# Altium schematic sheet Power 12V_5V.SchDoc
size 250 x 320 mm; SheetNumber: 3; SheetTotal: 12
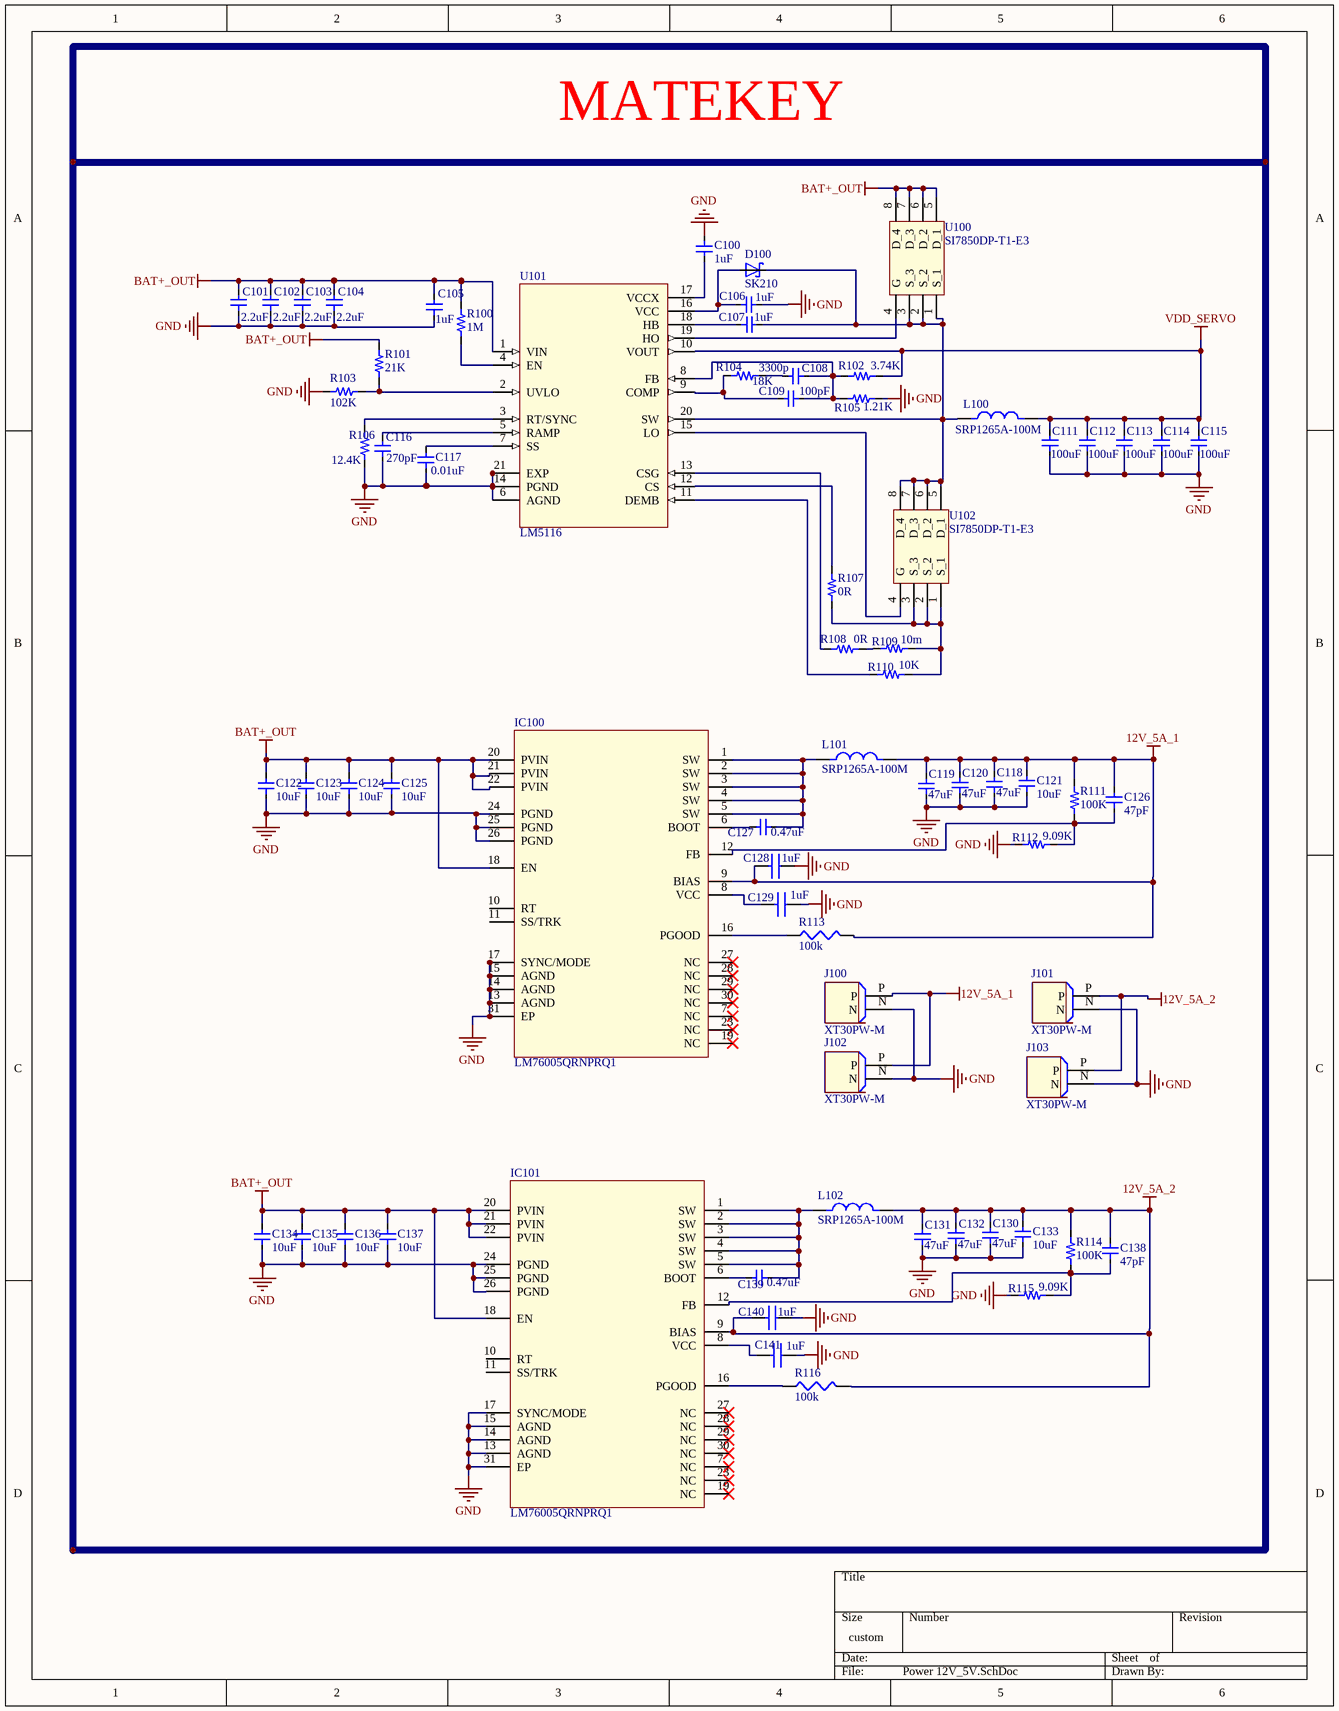
[diagram p0: Power 12V_5V.SchDoc]

## Parts
C100  1uF  [C0603]
C101  2.2uF  [C1812]
C102  2.2uF  [C1812]
C103  2.2uF  [C1812]
C104  2.2uF  [C1812]
C105  1uF  [C1210]
C106  1uF  [C0603]
C107  1uF  [C0603]
C108  3300p  [C0603]
C109  100pF  [C0603]
C111  100uF  [C1812]
C112  100uF  [C1812]
C113  100uF  [C1812]
C114  100uF  [C1812]
C115  100uF  [C1812]
C116  270pF  [C0603]
C117  0.01uF  [C0603]
C118  47uF  [C1210]
C119  47uF  [C1210]
C120  47uF  [C1210]
C121  10uF  [C0603]
C122  10uF  [C1206]
C123  10uF  [C1206]
C124  10uF  [C1206]
C125  10uF  [C1206]
C126  47pF  [C0603]
C127  0.47uF  [C0603]
C128  1uF  [C0402]
C129  1uF  [C0402]
C130  47uF  [C1210]
C131  47uF  [C1210]
C132  47uF  [C1210]
C133  10uF  [C0603]
C134  10uF  [C1206]
C135  10uF  [C1206]
C136  10uF  [C1206]
C137  10uF  [C1206]
C138  47pF  [C0603]
C139  0.47uF  [C0603]
C140  1uF  [C0402]
C141  1uF  [C0402]
D100  SK210  [SK210]
IC100  LM76005QRNPRQ1  [30-WFQFN Exposed Pad]
IC101  LM76005QRNPRQ1  [30-WFQFN Exposed Pad]
J100  XT30PW-M  [XT30PW-M]
J101  XT30PW-M  [XT30PW-M]
J102  XT30PW-M  [XT30PW-M]
J103  XT30PW-M  [XT30PW-M]
L100  SRP1265A-100M  [SRP1265A-100M]
L101  SRP1265A-100M  [SRP1265A-100M]
L102  SRP1265A-100M  [SRP1265A-100M]
R100  1M  [R0603]
R101  21K  [R0603]
R102  3.74K  [R0603]
R103  102K  [R0603]
R104  18K  [R0603]
R105  1.21K  [R0603]
R106  12.4K  [R0603]
R107  0R  [R0603]
R108  0R  [R0603]
R109  10m  [R2010]
R110  10K  [R0402]
R111  100K  [R0603]
R112  9.09K  [R0603]
R113  100k  [R0402]
R114  100K  [R0603]
R115  9.09K  [R0603]
R116  100k  [R0402]
U100  SI7850DP-T1-E3  [SO-8 Single]
U101  LM5116  [HTSSOP-20]
U102  SI7850DP-T1-E3  [SO-8 Single]

## Nets
12V_5A_1: C118.2 C119.2 C120.2 C121.2 C126.2 C128.2 IC100.9(BIAS) J100.P J102.P L101.2 R111.2 R113.2
12V_5A_2: C130.2 C131.2 C132.2 C133.2 C138.2 C140.2 IC101.9(BIAS) J101.P J103.P L102.2 R114.2 R116.2
BAT+_OUT: C101.2 C102.2 C103.2 C104.2 C105.2 C122.2 C123.2 C124.2 C125.2 C134.2 C135.2 C136.2 C137.2 IC100.18(EN) IC100.20(PVIN) IC100.21(PVIN) IC100.22(PVIN) IC101.18(EN) IC101.20(PVIN) IC101.21(PVIN) IC101.22(PVIN) R100.2 R101.1 U100.5(D_1) U100.6(D_2) U100.7(D_3) U100.8(D_4) U101.1(VIN)
GND: C100.1 C101.1 C102.1 C103.1 C104.1 C105.1 C106.2 C111.1 C112.1 C113.1 C114.1 C115.1 C116.1 C117.1 C118.1 C119.1 C120.1 C121.1 C122.1 C123.1 C124.1 C125.1 C128.1 C129.1 C130.1 C131.1 C132.1 C133.1 C134.1 C135.1 C136.1 C137.1 C140.1 C141.1 IC100.13(AGND) IC100.14(AGND) IC100.15(AGND) IC100.17(SYNC/MODE) IC100.24(PGND) IC100.25(PGND) IC100.26(PGND) IC100.31(EP) IC101.13(AGND) IC101.14(AGND) IC101.15(AGND) IC101.17(SYNC/MODE) IC101.24(PGND) IC101.25(PGND) IC101.26(PGND) IC101.31(EP) J100.N J101.N J102.N J103.N R103.2 R105.1 R106.1 R112.1 R115.1 U101.14(PGND) U101.21(EXP)
VDD_SERVO: C111.2 C112.2 C113.2 C114.2 C115.2 L100.2 R102.2 U101.10(VOUT)
NetC100_2: C100.2 U101.17(VCCX)
NetC106_1: C106.1 D100.A U101.16(VCC)
NetC107_1: C107.1 U101.18(HB)
NetC107_2: C107.2 D100.K L100.1 U100.1(S_1) U100.2(S_2) U100.3(S_3) U101.20(SW) U102.5(D_1) U102.6(D_2) U102.7(D_3) U102.8(D_4)
NetC108_1: C108.1 C109.1 R102.1 R105.2 U101.8(FB)
NetC108_2: C108.2 R104.1
NetC109_2: C109.2 R104.2 U101.9(COMP)
NetC116_2: C116.2 U101.5(RAMP)
NetC117_2: C117.2 U101.7(SS)
NetC126_1: C126.1 IC100.12(FB) R111.1 R112.2
NetC127_1: C127.1 IC100.1(SW) IC100.2(SW) IC100.3(SW) IC100.4(SW) IC100.5(SW) L101.1
NetC127_2: C127.2 IC100.6(BOOT)
NetC129_2: C129.2 IC100.8(VCC)
NetC138_1: C138.1 IC101.12(FB) R114.1 R115.2
NetC139_1: C139.1 IC101.1(SW) IC101.2(SW) IC101.3(SW) IC101.4(SW) IC101.5(SW) L102.1
NetC139_2: C139.2 IC101.6(BOOT)
NetC141_2: C141.2 IC101.8(VCC)
NetIC100_16: IC100.16(PGOOD) R113.1
NetIC101_16: IC101.16(PGOOD) R116.1
NetR100_1: R100.1 U101.4(EN)
NetR101_2: R101.2 R103.1 U101.2(UVLO)
NetR106_2: R106.2 U101.3(RT/SYNC)
NetR107_1: R107.1 R109.1 R110.2 U102.1(S_1) U102.2(S_2) U102.3(S_3)
NetR107_2: R107.2 U101.12(CS)
NetR108_1: R108.1 U101.13(CSG)
NetR108_2: R108.2 R109.2
NetR110_1: R110.1 U101.11(DEMB)
NetU100_4: U100.4(G) U101.19(HO)
NetU101_15: U101.15(LO) U102.4(G)

Not connected (* = marked no-connect by the designer): IC100 7(NC)* 10(RT) 11(SS/TRK) 19(NC)* 23(NC)* 27(NC)* 28(NC)* 29(NC)* 30(NC)*; IC101 7(NC)* 10(RT) 11(SS/TRK) 19(NC)* 23(NC)* 27(NC)* 28(NC)* 29(NC)* 30(NC)*; U101 6(AGND)

## Notes on the sheet
- MATEKEY

## Library data of the parts
C100 C106 C107 = CC0603KRX5R8BB105: 1 µF ±10% 25V Ceramic Capacitor X5R 0603 (1608 Metric)
C101-C104 = C4532X7R2A225M230KA: 2.2 µF ±20% 100V Ceramic Capacitor X7R 1812 (4532 Metric)
C105 = C3225X7R2A105M200AA: 1 µF ±20% 100V Ceramic Capacitor X7R 1210 (3225 Metric)
C108 = VJ0603Y332KXXAC: 3300 pF ±10% 25V Ceramic Capacitor X7R 0603 (1608 Metric)
C109 = CC0603KRX7R8BB101: 100 pF ±10% 25V Ceramic Capacitor X7R 0603 (1608 Metric)
C111-C115 = C4532X6S0J107M280KC: CAP CER 100UF 6.3V X6S 1812
C116 = CC0603JRNPO9BN271: 270 pF ±5% 50V Ceramic Capacitor C0G, NP0 0603 (1608 Metric)
C117 = C0603C103J5REC7411: 10000 pF ±5% 50V Ceramic Capacitor X7R 0603 (1608 Metric)
C118-C120 C130-C132 = TMK325ABJ476MM-T: 47 µF ±20% 25V Ceramic Capacitor X5R 1210 (3225 Metric)
C121 C133 = CC0603KRX5R6BB106: 10 µF ±10% 10V Ceramic Capacitor X5R 0603 (1608 Metric)
C122-C125 C134-C137 = C3216X6S2A106K160AC: 10 µF ±10% 100V Ceramic Capacitor X6S 1206 (3216 Metric)
C126 C138 = CC0603JRNPO8BN470: 47 pF ±5% 25V Ceramic Capacitor C0G, NP0 0603 (1608 Metric)
C127 C139 = CC0603KRX5R9BB474: 0.47 µF ±10% 50V Ceramic Capacitor X5R 0603 (1608 Metric)
C128 C129 C140 C141 = EMK105BJ105MV-F: CAP CER 1UF 16V X5R 0402; Supplier 1: Digikey; Supplier Part Number 1: 587-5514-1-ND
D100 = SK210: Diode 100 V 2A Surface Mount DO-214AA (SMB)
IC100 IC101 = LM76005QRNPRQ1: Buck Switching Regulator IC Positive Adjustable 1V 1 Output 5A 30-WFQFN Exposed Pad
J100-J103 = XT30PW-M: Socket; DC supply; XT30; male; PIN: 2; on PCBs; THT; Colour: yellow
L100-L102 = SRP1265A-100M: FIXED IND 10UH 10A 16.5 MOHM SMD
R100 = RT0603BRD071ML: 1 MOhms ±0.1% 0.1W, 1/10W Chip Resistor 0603 (1608 Metric) Thin Film
R101 = RC0603FR-0721KL: 21 kOhms ±1% 0.1W, 1/10W Chip Resistor 0603 (1608 Metric) Moisture Resistant Thick Film
R102 = RC0603FR-073K74L: 3.74 kOhms ±1% 0.1W, 1/10W Chip Resistor 0603 (1608 Metric) Moisture Resistant Thick Film
R103 = RT0603BRD07102KL: 102 kOhms ±0.1% 0.1W, 1/10W Chip Resistor 0603 (1608 Metric) Thin Film
R104 = RC0603FR-0718KL: 18 kOhms ±1% 0.1W, 1/10W Chip Resistor 0603 (1608 Metric) Moisture Resistant Thick Film
R105 = RC0603FR-071K21L: 1.21 kOhms ±1% 0.1W, 1/10W Chip Resistor 0603 (1608 Metric) Moisture Resistant Thick Film
R106 = RC0603FR-0712K4L: 12.4 kOhms ±1% 0.1W, 1/10W Chip Resistor 0603 (1608 Metric) Moisture Resistant Thick Film
R107 R108 = CR0603AJ/-000EAS: 0 Ohms Jumper Chip Resistor 0603 (1608 Metric) Anti-Sulfur, Automotive AEC-Q200, Moisture Resistant Thick Film
R109 = TLR2H15DR010FTDG: 10 mOhms ±1% 1.5W Chip Resistor 2010 (5025 Metric) Current Sense Metal Foil
R110 = RC1005F103CS: RES SMD 10K OHM 1% 1/16W 0402
R111 R114 = RC0603FR-07100KL: 100 kOhms ±1% 0.1W, 1/10W Chip Resistor 0603 (1608 Metric) Moisture Resistant Thick Film
R112 R115 = RMCF0603FT9K09: 9.09 kOhms ±1% 0.1W, 1/10W Chip Resistor 0603 (1608 Metric) Automotive AEC-Q200 Thick Film
R113 R116 = AC0402JR-07100KL: RES SMD 100K OHM 5% 1/16W 0402; Supplier 1: Future Electronics; Supplier Part Number 1: 3031172
U100 U102 = SI7850DP-T1-E3: MOSFETs 60V Vds 20V Vgs PowerPAK SO-8
U101 = LM5116MHX/NOPB: 6-100V Wide Vin, Current Mode Synchronous Buck Controller